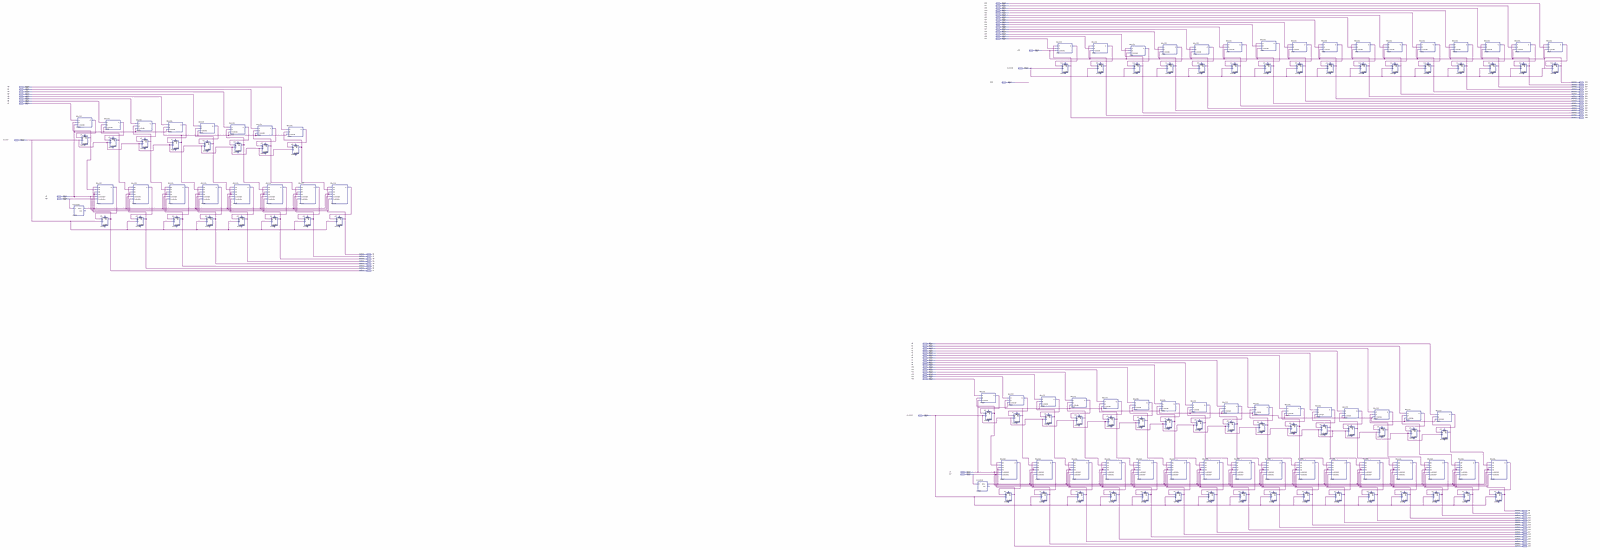
[diagram p0: schematic sheet, whole]
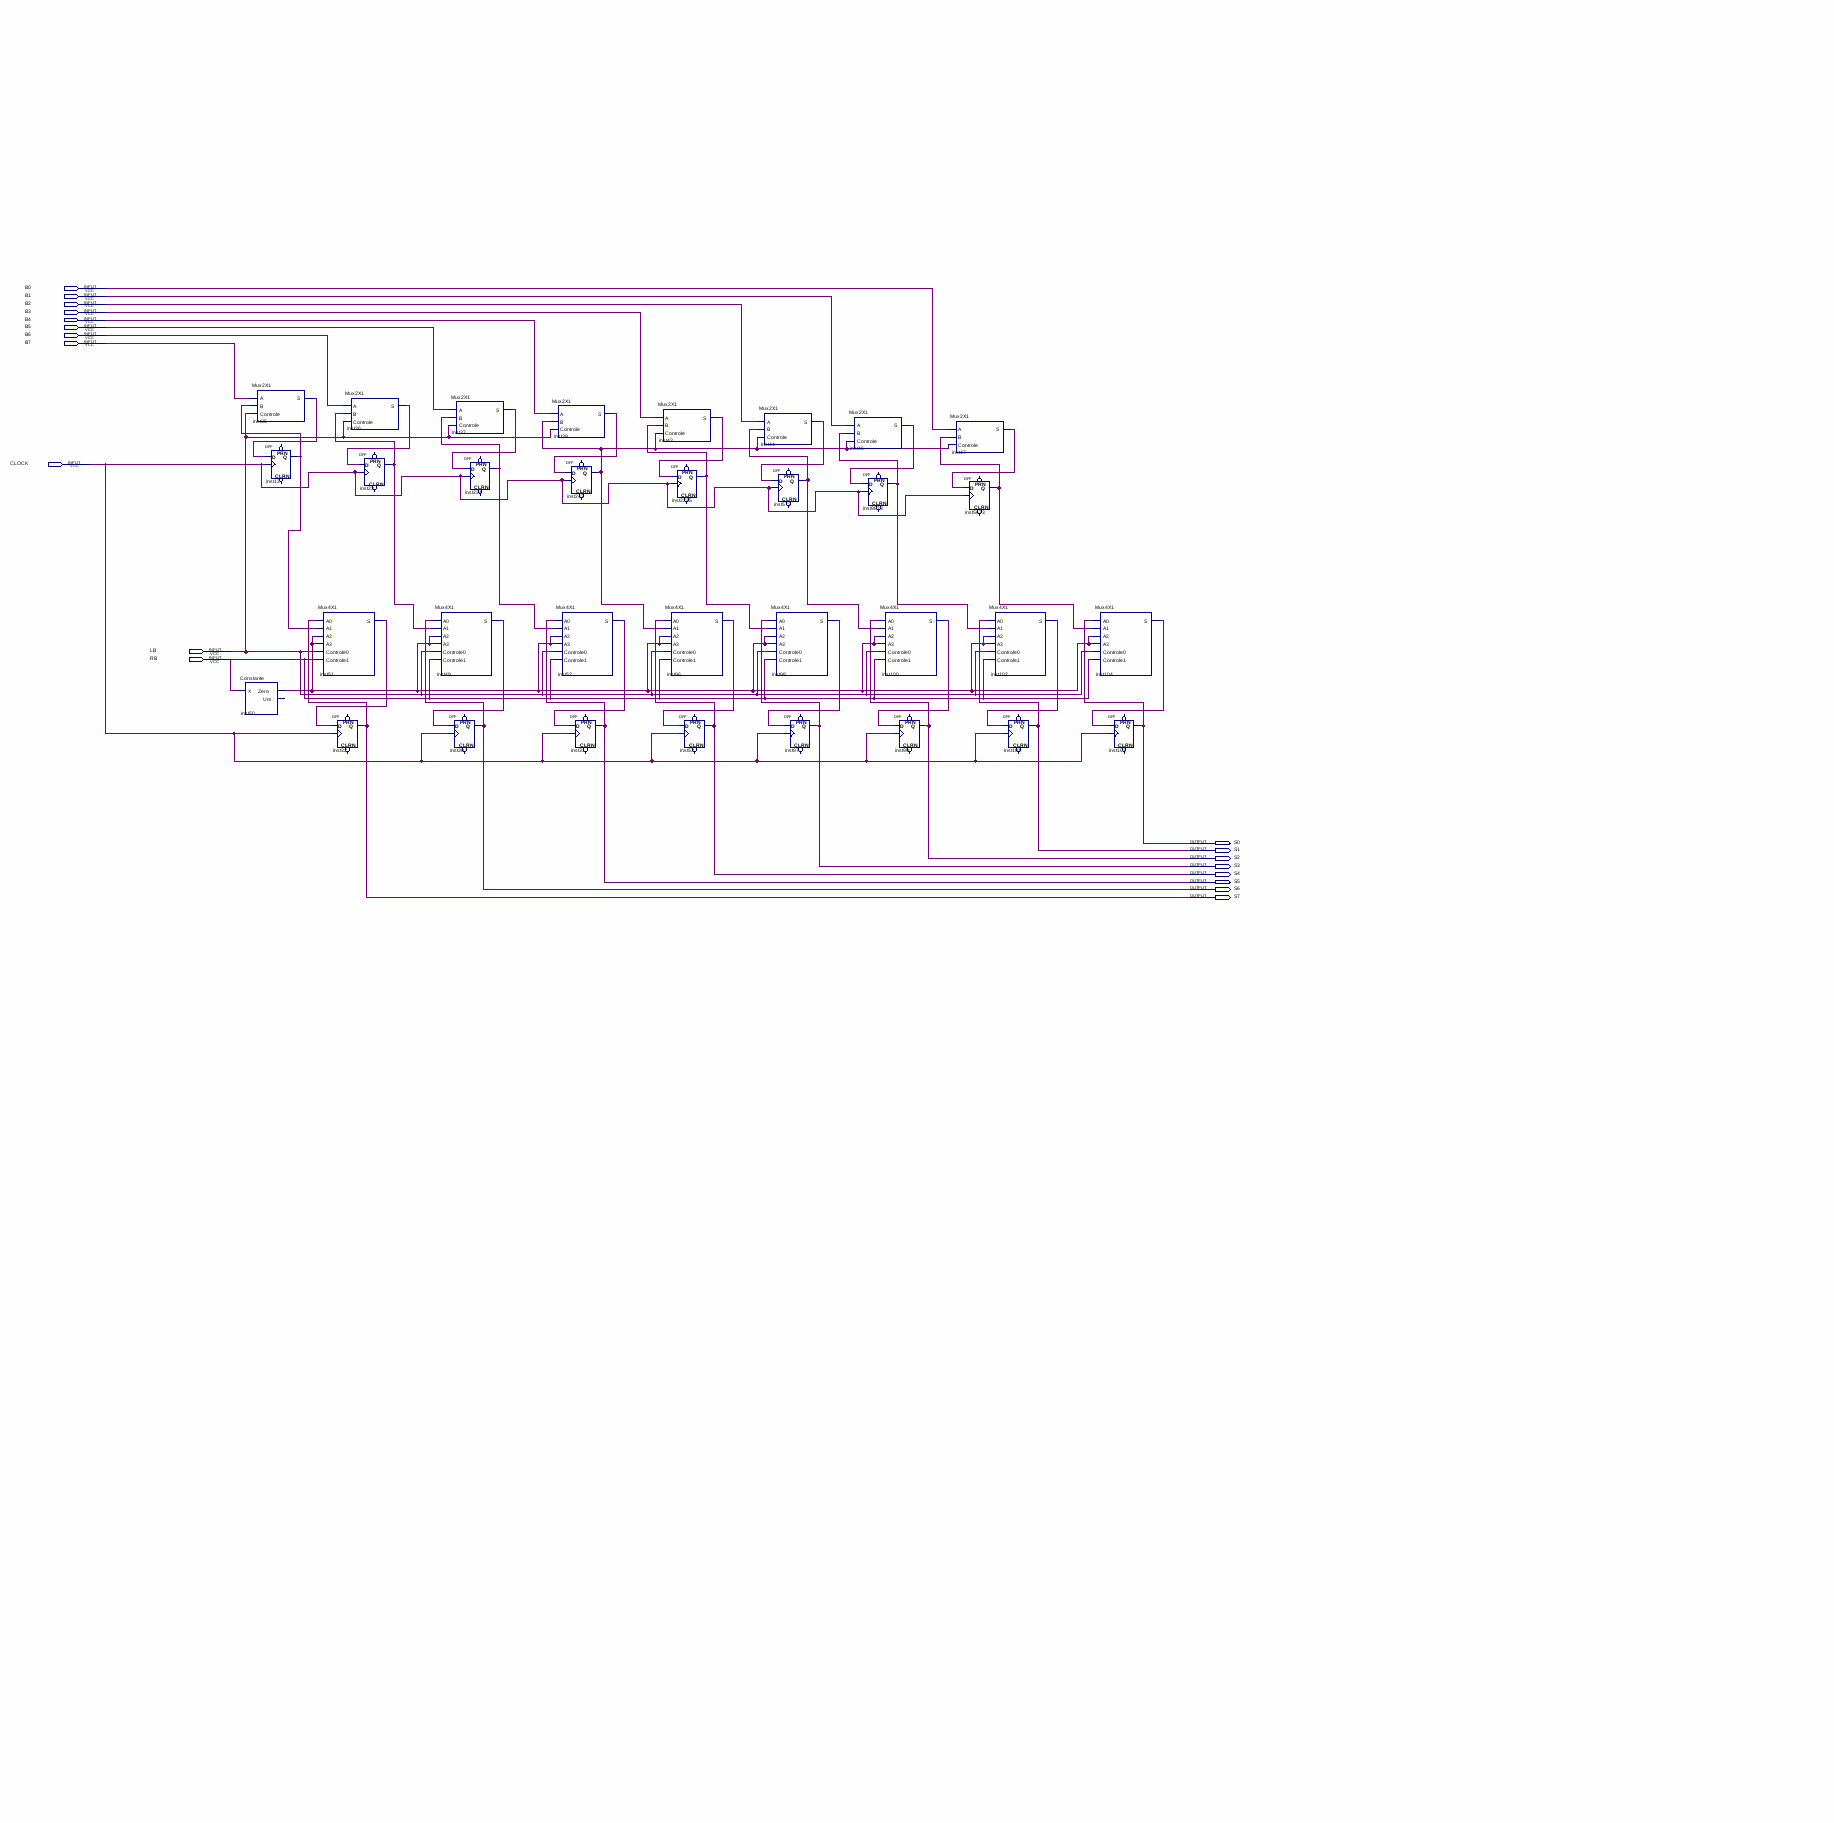
[diagram p1: schematic sheet, left part]
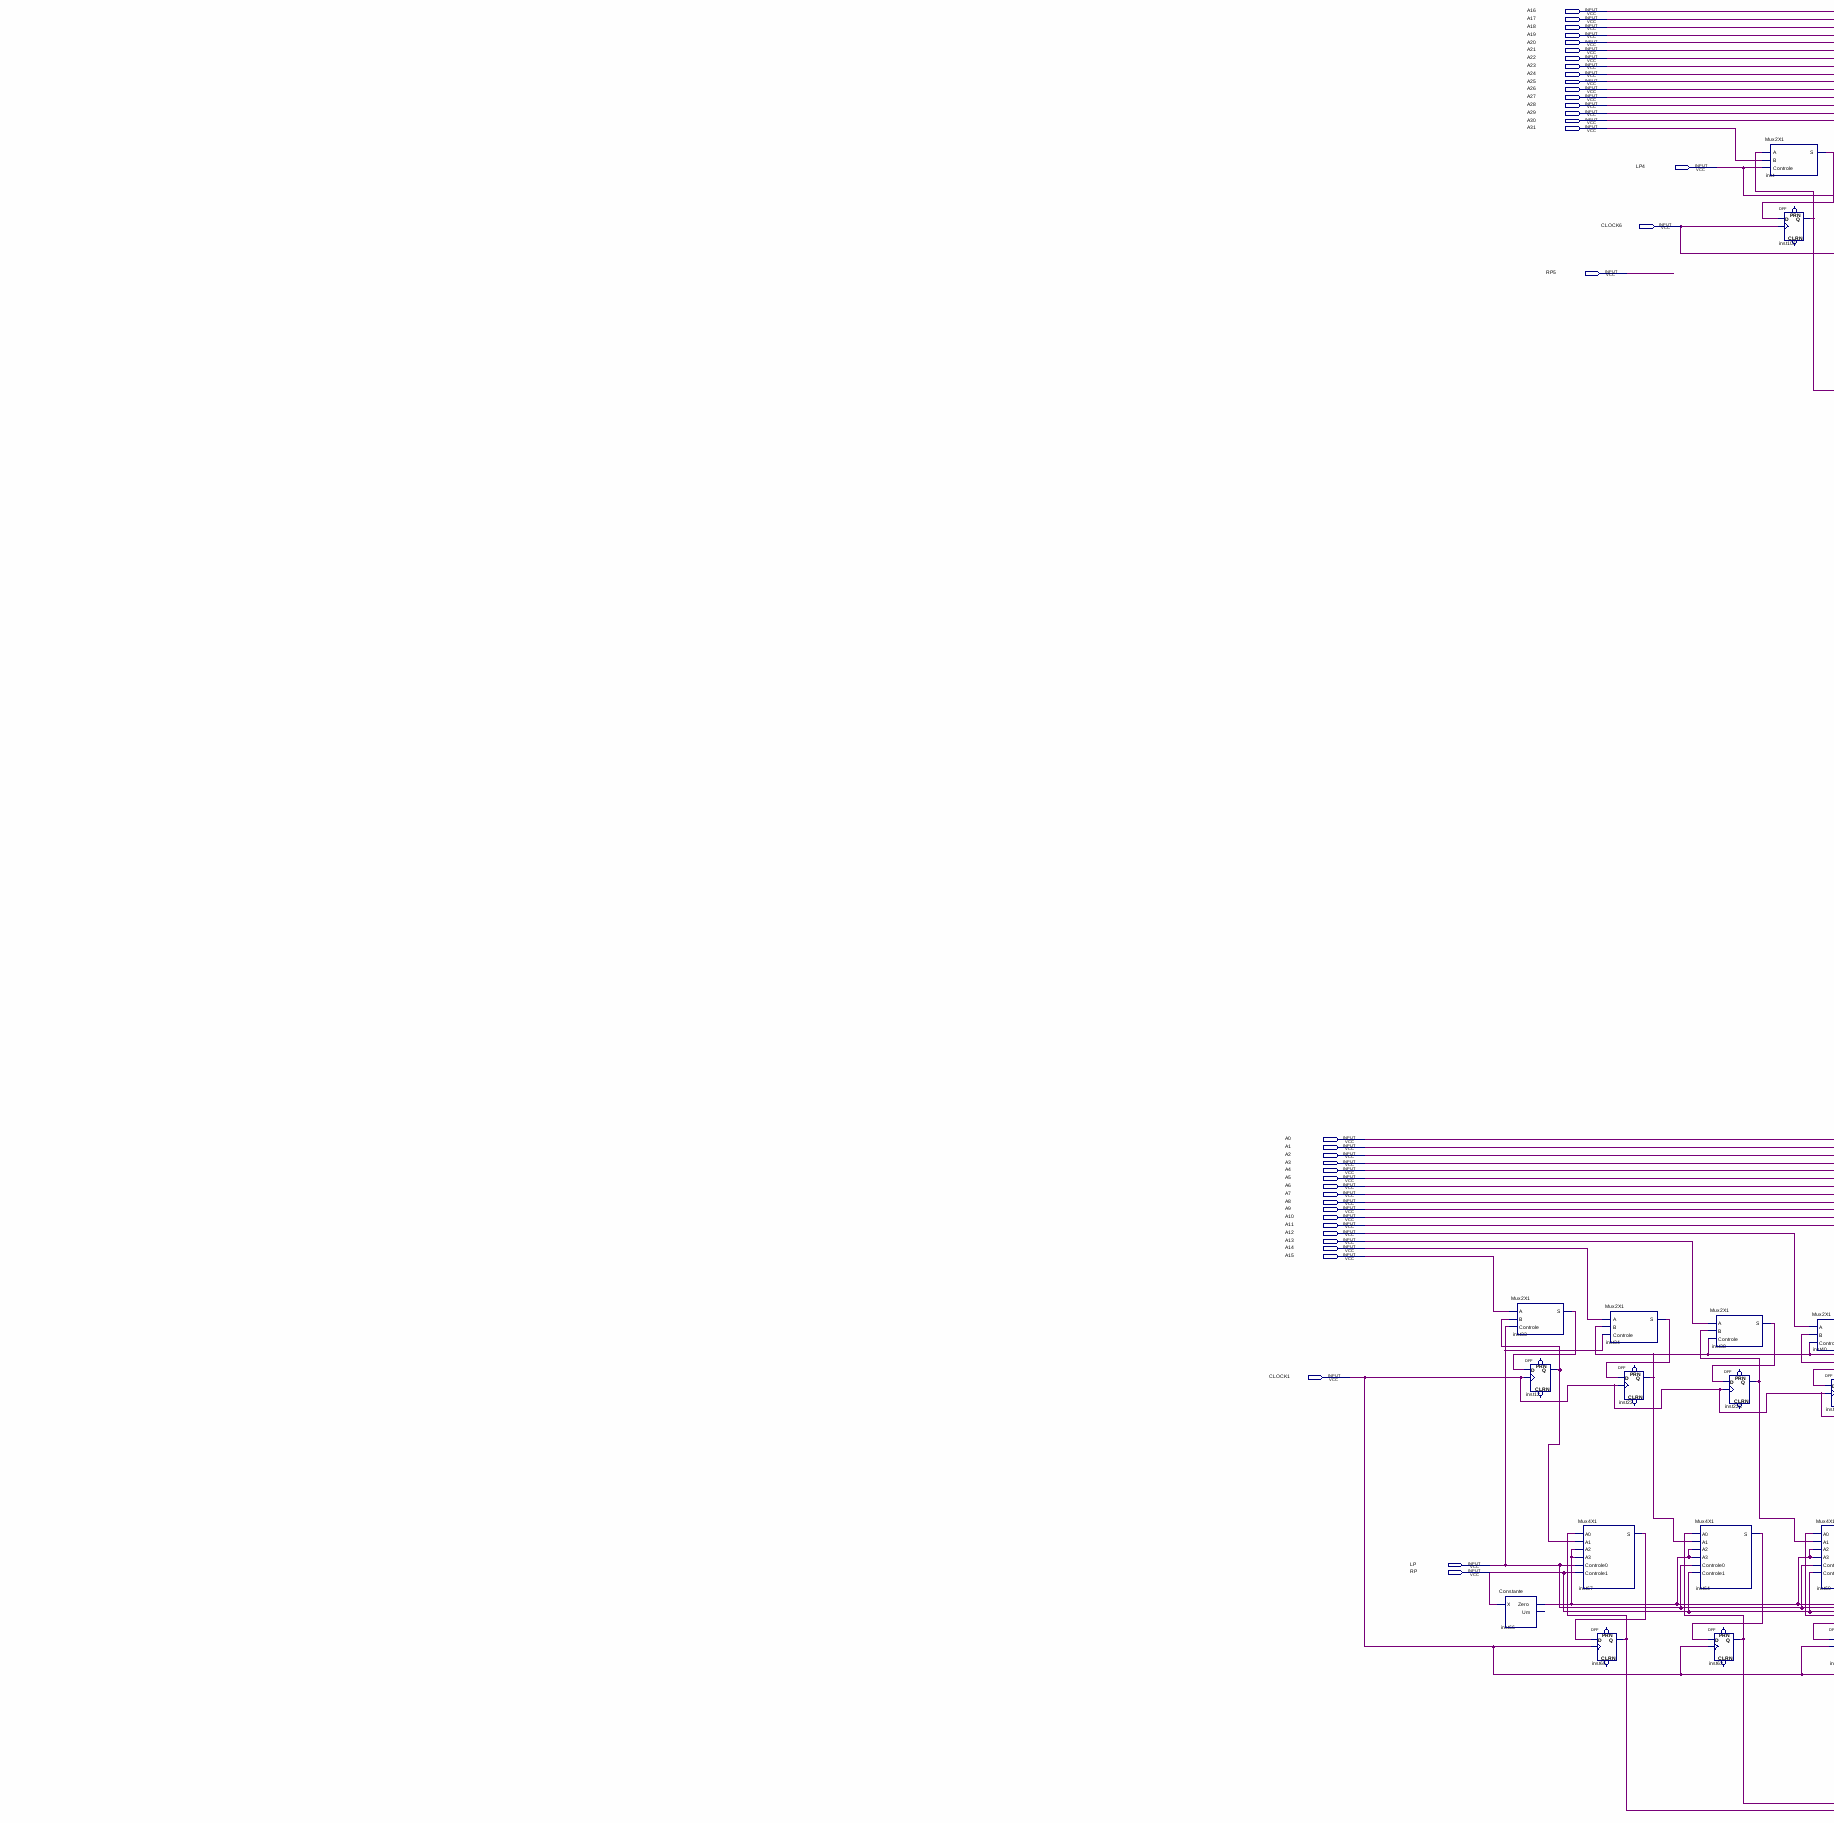
[diagram p2: schematic sheet, centre part]
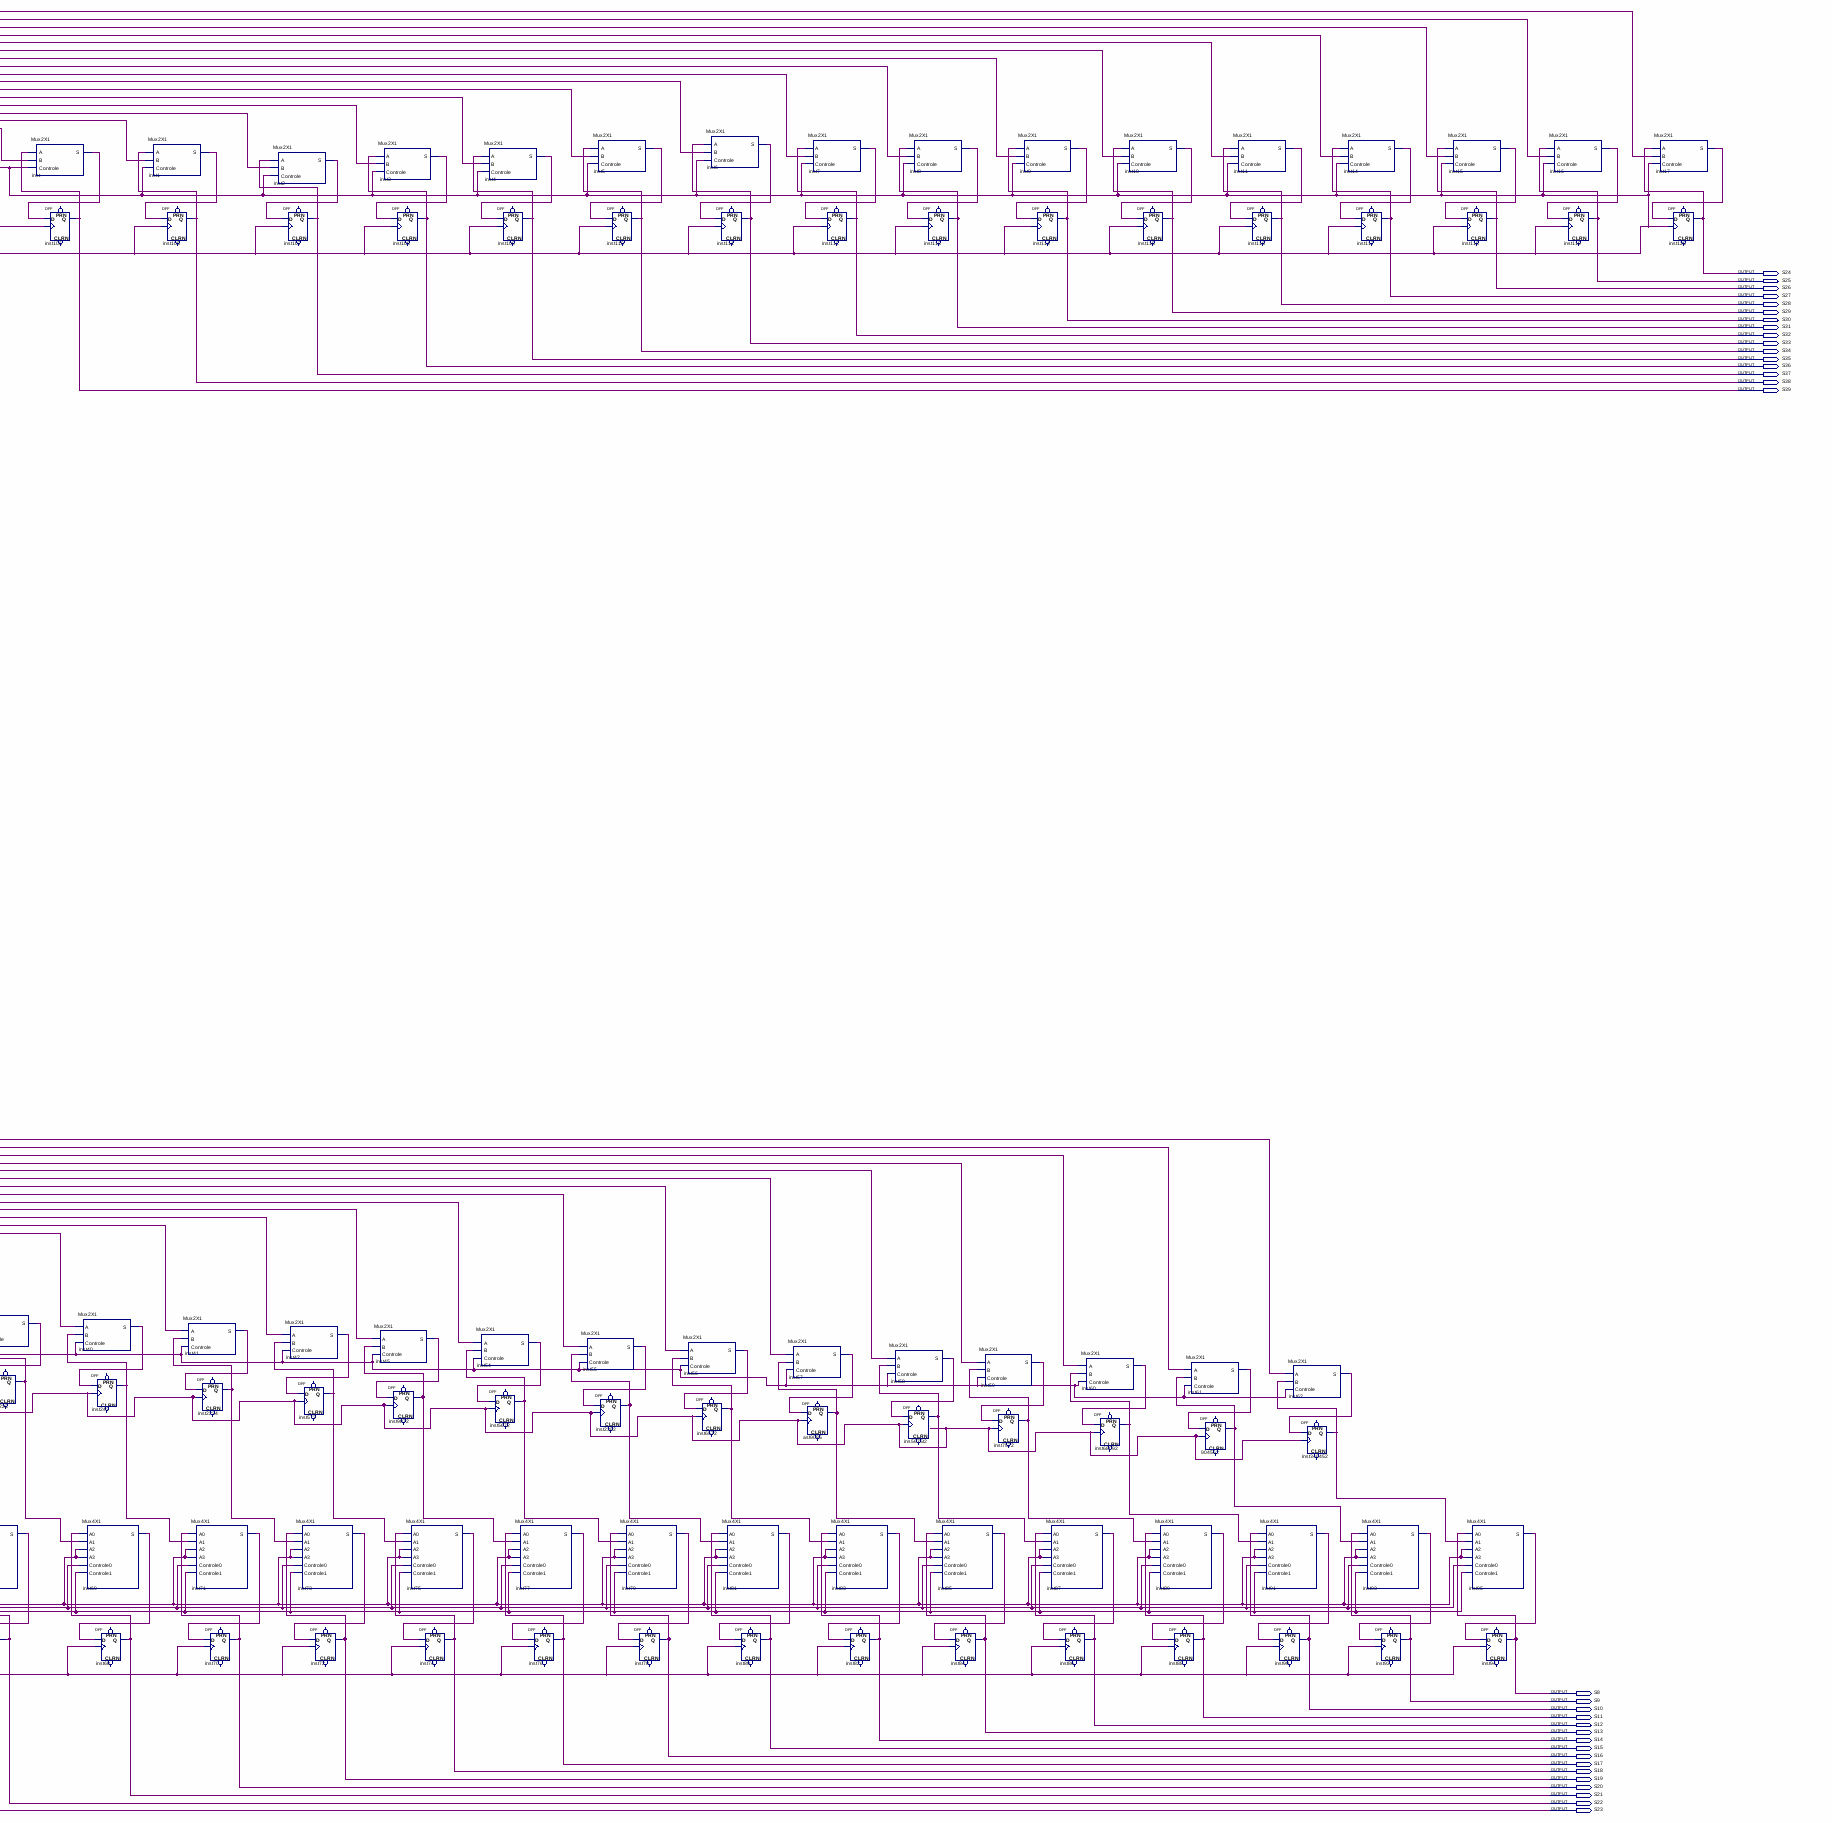
[diagram p3: schematic sheet, right part]
// Quartus schematic Rascunho.bdf as structural Verilog: 130 symbols, 89 pins
module Rascunho (
  input  A16,
  input  A17,
  input  A18,
  input  A19,
  input  A20,
  input  A21,
  input  A22,
  input  A23,
  input  A24,
  input  A25,
  input  A26,
  input  A27,
  input  A28,
  input  A29,
  input  A30,
  input  A31,
  input  LP4,
  input  CLOCK6,
  input  RP5,
  input  B0,
  input  B1,
  input  B2,
  input  B3,
  input  B4,
  input  B5,
  input  B6,
  input  B7,
  input  CLOCK,
  input  LB,
  input  RB,
  input  A0,
  input  A1,
  input  A2,
  input  A3,
  input  A4,
  input  A5,
  input  A6,
  input  A7,
  input  A8,
  input  A9,
  input  A10,
  input  A11,
  input  A12,
  input  A13,
  input  A14,
  input  A15,
  input  CLOCK1,
  input  LP,
  input  RP,
  output S24,
  output S25,
  output S26,
  output S27,
  output S28,
  output S29,
  output S30,
  output S31,
  output S32,
  output S33,
  output S34,
  output S35,
  output S36,
  output S37,
  output S38,
  output S39,
  output S0,
  output S1,
  output S2,
  output S3,
  output S4,
  output S5,
  output S6,
  output S7,
  output S8,
  output S9,
  output S10,
  output S11,
  output S12,
  output S13,
  output S14,
  output S15,
  output S16,
  output S17,
  output S18,
  output S19,
  output S20,
  output S21,
  output S22,
  output S23
);

  wire asf9085_q, ins5675t2_q, inst1_s, inst2_s, inst3_s, inst4_s, inst5_s, inst6_s, inst7_s, inst8_s,
       inst9_s, inst10_s, inst11_s, inst12_q, inst13_q, inst14_s, inst15_s, inst16_s, inst17_s, inst22_q,
       inst23_q, inst33_s, inst34_s, inst35_s, inst36_s, inst37_s, inst38_s, inst39_s, inst40_s, inst41_s,
       inst42_s, inst43_s, inst44_s, inst45_s, inst46_s, inst47_s, inst49_s, inst50_zero, inst51_s, inst52_s,
       inst54_s, inst55_s, inst56_s, inst57_s, inst58_s, inst59_s, inst60_s, inst61_s, inst62_s, inst64_s,
       inst66_zero, inst67_s, inst69_s, inst71_s, inst73_s, inst75_s, inst77_s, inst79_s, inst81_s, inst83_s,
       inst85_s, inst87_s, inst89_s, inst91_s, inst93_s, inst95_s, inst96_s, inst98_s, inst100_s, inst102_s,
       inst104_s, inst223_q, inst224_q, inst242_q, inst243_q, inst572_q, inst573_q, inst2234_q, inst2235_q,
       inst2352_q, inst5672_q, inst5673_q, inst6572_q, inst7572_q, inst9872_q, inst9873_q, inst68092_q,
       inst346452_q, inst_s, n904562_q;

  Constante inst50 (.X(RB), .Zero(inst50_zero));  // open: Um
  Mux2X1 inst35 (.A(B7), .B(inst13_q), .Controle(LB), .S(inst35_s));
  DFF inst13 (.CLK(CLOCK), .D(inst35_s), .Q(inst13_q));  // open: CLRN, PRN
  Mux4X1 inst51 (
    .A0(S7), .A1(inst13_q), .A2(inst50_zero), .A3(inst50_zero), .Controle0(LB), .Controle1(RB), .S(inst51_s));
  DFF inst32 (.CLK(CLOCK), .D(inst51_s), .Q(S7));  // open: CLRN, PRN
  Mux2X1 inst36 (.A(B6), .B(inst23_q), .Controle(LB), .S(inst36_s));
  DFF inst23 (.CLK(CLOCK), .D(inst36_s), .Q(inst23_q));  // open: CLRN, PRN
  Mux4X1 inst49 (
    .A0(S6), .A1(inst23_q), .A2(inst50_zero), .A3(inst50_zero), .Controle0(LB), .Controle1(RB), .S(inst49_s));
  Mux2X1 inst37 (.A(B5), .B(inst224_q), .Controle(LB), .S(inst37_s));
  DFF inst224 (.CLK(CLOCK), .D(inst37_s), .Q(inst224_q));  // open: CLRN, PRN
  DFF inst30 (.CLK(CLOCK), .D(inst49_s), .Q(S6));  // open: CLRN, PRN
  Mux2X1 inst39 (.A(B4), .B(inst243_q), .Controle(LB), .S(inst39_s));
  Mux4X1 inst52 (
    .A0(S5), .A1(inst224_q), .A2(inst50_zero), .A3(inst50_zero), .Controle0(LB), .Controle1(RB), .S(inst52_s));
  DFF inst243 (.CLK(CLOCK), .D(inst39_s), .Q(inst243_q));  // open: CLRN, PRN
  DFF inst31 (.CLK(CLOCK), .D(inst52_s), .Q(S5));  // open: CLRN, PRN
  Mux2X1 inst43 (.A(B3), .B(inst2235_q), .Controle(inst243_q), .S(inst43_s));
  DFF inst2235 (.CLK(CLOCK), .D(inst43_s), .Q(inst2235_q));  // open: CLRN, PRN
  Mux4X1 inst96 (
    .A0(S4), .A1(inst243_q), .A2(inst50_zero), .A3(inst50_zero), .Controle0(LB), .Controle1(RB), .S(inst96_s));
  DFF inst53 (.CLK(CLOCK), .D(inst96_s), .Q(S4));  // open: CLRN, PRN
  Mux2X1 inst44 (.A(B2), .B(inst573_q), .Controle(inst243_q), .S(inst44_s));
  DFF inst573 (.CLK(CLOCK), .D(inst44_s), .Q(inst573_q));  // open: CLRN, PRN
  Mux4X1 inst98 (
    .A0(S3), .A1(inst2235_q), .A2(inst50_zero), .A3(inst50_zero), .Controle0(LB), .Controle1(RB), .S(inst98_s));
  DFF inst97 (.CLK(CLOCK), .D(inst98_s), .Q(S3));  // open: CLRN, PRN
  Mux2X1 inst46 (.A(B1), .B(inst9873_q), .Controle(inst243_q), .S(inst46_s));
  DFF inst9873 (.CLK(CLOCK), .D(inst46_s), .Q(inst9873_q));  // open: CLRN, PRN
  Mux4X1 inst100 (
    .A0(S2), .A1(inst573_q), .A2(inst50_zero), .A3(inst50_zero), .Controle0(LB), .Controle1(RB), .S(inst100_s));
  DFF inst99 (.CLK(CLOCK), .D(inst100_s), .Q(S2));  // open: CLRN, PRN
  Mux2X1 inst47 (.A(B0), .B(inst5673_q), .Controle(inst243_q), .S(inst47_s));
  DFF inst5673 (.CLK(CLOCK), .D(inst47_s), .Q(inst5673_q));  // open: CLRN, PRN
  Mux4X1 inst102 (
    .A0(S1), .A1(inst9873_q), .A2(inst50_zero), .A3(inst50_zero), .Controle0(LB), .Controle1(RB),
    .S(inst102_s));
  DFF inst101 (.CLK(CLOCK), .D(inst102_s), .Q(S1));  // open: CLRN, PRN
  Mux4X1 inst104 (
    .A0(S0), .A1(inst5673_q), .A2(inst50_zero), .A3(inst50_zero), .Controle0(LB), .Controle1(RB),
    .S(inst104_s));
  DFF inst103 (.CLK(CLOCK), .D(inst104_s), .Q(S0));  // open: CLRN, PRN
  Mux2X1 inst33 (.A(A15), .B(inst12_q), .Controle(LP), .S(inst33_s));
  Constante inst66 (.X(RP), .Zero(inst66_zero));  // open: Um
  DFF inst12 (.CLK(CLOCK1), .D(inst33_s), .Q(inst12_q));  // open: CLRN, PRN
  Mux2X1 inst34 (.A(A14), .B(inst22_q), .Controle(LP), .S(inst34_s));
  Mux4X1 inst67 (
    .A0(S23), .A1(inst12_q), .A2(inst66_zero), .A3(inst66_zero), .Controle0(LP), .Controle1(RP), .S(inst67_s));
  DFF inst65 (.CLK(CLOCK1), .D(inst67_s), .Q(S23));  // open: CLRN, PRN
  DFF inst22 (.CLK(CLOCK1), .D(inst34_s), .Q(inst22_q));  // open: CLRN, PRN
  Mux4X1 inst64 (
    .A0(S22), .A1(inst22_q), .A2(inst66_zero), .A3(inst66_zero), .Controle0(LP), .Controle1(RP), .S(inst64_s));
  Mux2X1 inst38 (.A(A13), .B(inst223_q), .Controle(inst22_q), .S(inst38_s));
  DFF inst223 (.CLK(CLOCK1), .D(inst38_s), .Q(inst223_q));  // open: CLRN, PRN
  DFF inst63 (.CLK(CLOCK1), .D(inst64_s), .Q(S22));  // open: CLRN, PRN
  Mux2X1 inst (.A(S39), .B(A31), .Controle(CLOCK6), .S(inst_s));
  DFF inst106 (.CLK(CLOCK6), .D(inst_s), .Q(S39));  // open: CLRN, PRN
  Mux2X1 inst40 (.A(A12), .B(inst242_q), .Controle(inst22_q), .S(inst40_s));
  Mux4X1 inst69 (
    .A0(S21), .A1(inst223_q), .A2(inst66_zero), .A3(inst66_zero), .Controle0(LP), .Controle1(RP), .S(inst69_s));
  DFF inst242 (.CLK(CLOCK1), .D(inst40_s), .Q(inst242_q));  // open: CLRN, PRN
  DFF inst68 (.CLK(CLOCK1), .D(inst69_s), .Q(S21));  // open: CLRN, PRN
  Mux2X1 inst1 (.A(S38), .B(A30), .Controle(CLOCK6), .S(inst1_s));
  DFF inst105 (.CLK(CLOCK6), .D(inst1_s), .Q(S38));  // open: CLRN, PRN
  Mux2X1 inst41 (.A(A11), .B(inst2234_q), .Controle(inst22_q), .S(inst41_s));
  DFF inst2234 (.CLK(CLOCK1), .D(inst41_s), .Q(inst2234_q));  // open: CLRN, PRN
  Mux4X1 inst71 (
    .A0(S20), .A1(inst242_q), .A2(inst66_zero), .A3(inst66_zero), .Controle0(LP), .Controle1(RP), .S(inst71_s));
  DFF inst70 (.CLK(CLOCK1), .D(inst71_s), .Q(S20));  // open: CLRN, PRN
  Mux2X1 inst2 (.A(S37), .B(A29), .Controle(CLOCK6), .S(inst2_s));
  DFF inst107 (.CLK(CLOCK6), .D(inst2_s), .Q(S37));  // open: CLRN, PRN
  Mux2X1 inst42 (.A(A10), .B(inst572_q), .Controle(inst22_q), .S(inst42_s));
  DFF inst572 (.CLK(CLOCK1), .D(inst42_s), .Q(inst572_q));  // open: CLRN, PRN
  Mux4X1 inst73 (
    .A0(S19), .A1(inst2234_q), .A2(inst66_zero), .A3(inst66_zero), .Controle0(LP), .Controle1(RP),
    .S(inst73_s));
  DFF inst72 (.CLK(CLOCK1), .D(inst73_s), .Q(S19));  // open: CLRN, PRN
  Mux2X1 inst3 (.A(S36), .B(A28), .Controle(CLOCK6), .S(inst3_s));
  DFF inst108 (.CLK(CLOCK6), .D(inst3_s), .Q(S36));  // open: CLRN, PRN
  Mux2X1 inst45 (.A(A9), .B(inst9872_q), .Controle(inst22_q), .S(inst45_s));
  DFF inst9872 (.CLK(CLOCK1), .D(inst45_s), .Q(inst9872_q));  // open: CLRN, PRN
  Mux4X1 inst75 (
    .A0(S18), .A1(inst572_q), .A2(inst66_zero), .A3(inst66_zero), .Controle0(LP), .Controle1(RP), .S(inst75_s));
  DFF inst74 (.CLK(CLOCK1), .D(inst75_s), .Q(S18));  // open: CLRN, PRN
  Mux2X1 inst4 (.A(S35), .B(A27), .Controle(CLOCK6), .S(inst4_s));
  Mux2X1 inst54 (.A(A8), .B(inst5672_q), .Controle(inst22_q), .S(inst54_s));
  DFF inst5672 (.CLK(CLOCK1), .D(inst54_s), .Q(inst5672_q));  // open: CLRN, PRN
  DFF inst109 (.CLK(CLOCK6), .D(inst4_s), .Q(S35));  // open: CLRN, PRN
  Mux4X1 inst77 (
    .A0(S17), .A1(inst9872_q), .A2(inst66_zero), .A3(inst66_zero), .Controle0(LP), .Controle1(RP),
    .S(inst77_s));
  DFF inst76 (.CLK(CLOCK1), .D(inst77_s), .Q(S17));  // open: CLRN, PRN
  Mux2X1 inst55 (.A(A7), .B(inst2352_q), .Controle(inst22_q), .S(inst55_s));
  Mux2X1 inst5 (.A(S34), .B(A26), .Controle(CLOCK6), .S(inst5_s));
  DFF inst110 (.CLK(CLOCK6), .D(inst5_s), .Q(S34));  // open: CLRN, PRN
  DFF inst2352 (.CLK(CLOCK1), .D(inst55_s), .Q(inst2352_q));  // open: CLRN, PRN
  Mux4X1 inst79 (
    .A0(S16), .A1(inst5672_q), .A2(inst66_zero), .A3(inst66_zero), .Controle0(LP), .Controle1(RP),
    .S(inst79_s));
  DFF inst78 (.CLK(CLOCK1), .D(inst79_s), .Q(S16));  // open: CLRN, PRN
  Mux2X1 inst56 (.A(A6), .B(inst6572_q), .Controle(inst22_q), .S(inst56_s));
  Mux2X1 inst6 (.A(S33), .B(A25), .Controle(CLOCK6), .S(inst6_s));
  DFF inst6572 (.CLK(CLOCK1), .D(inst56_s), .Q(inst6572_q));  // open: CLRN, PRN
  DFF inst111 (.CLK(CLOCK6), .D(inst6_s), .Q(S33));  // open: CLRN, PRN
  Mux4X1 inst81 (
    .A0(S15), .A1(inst2352_q), .A2(inst66_zero), .A3(inst66_zero), .Controle0(LP), .Controle1(RP),
    .S(inst81_s));
  DFF inst80 (.CLK(CLOCK1), .D(inst81_s), .Q(S15));  // open: CLRN, PRN
  Mux2X1 inst7 (.A(S32), .B(A24), .Controle(CLOCK6), .S(inst7_s));
  Mux2X1 inst57 (.A(A5), .B(asf9085_q), .Controle(inst22_q), .S(inst57_s));
  DFF asf9085 (.CLK(CLOCK1), .D(inst57_s), .Q(asf9085_q));  // open: CLRN, PRN
  DFF inst112 (.CLK(CLOCK6), .D(inst7_s), .Q(S32));  // open: CLRN, PRN
  Mux4X1 inst83 (
    .A0(S14), .A1(inst6572_q), .A2(inst66_zero), .A3(inst66_zero), .Controle0(LP), .Controle1(RP),
    .S(inst83_s));
  DFF inst82 (.CLK(CLOCK1), .D(inst83_s), .Q(S14));  // open: CLRN, PRN
  Mux2X1 inst58 (.A(A4), .B(ins5675t2_q), .Controle(inst22_q), .S(inst58_s));
  Mux2X1 inst8 (.A(S31), .B(A23), .Controle(CLOCK6), .S(inst8_s));
  DFF inst113 (.CLK(CLOCK6), .D(inst8_s), .Q(S31));  // open: CLRN, PRN
  DFF ins5675t2 (.CLK(CLOCK1), .D(inst58_s), .Q(ins5675t2_q));  // open: CLRN, PRN
  Mux4X1 inst85 (
    .A0(S13), .A1(asf9085_q), .A2(inst66_zero), .A3(inst66_zero), .Controle0(LP), .Controle1(RP), .S(inst85_s));
  DFF inst84 (.CLK(CLOCK1), .D(inst85_s), .Q(S13));  // open: CLRN, PRN
  Mux2X1 inst59 (.A(A3), .B(inst7572_q), .Controle(inst22_q), .S(inst59_s));
  DFF inst7572 (.CLK(CLOCK1), .D(inst59_s), .Q(inst7572_q));  // open: CLRN, PRN
  Mux2X1 inst9 (.A(S30), .B(A22), .Controle(CLOCK6), .S(inst9_s));
  DFF inst114 (.CLK(CLOCK6), .D(inst9_s), .Q(S30));  // open: CLRN, PRN
  Mux4X1 inst87 (
    .A0(S12), .A1(ins5675t2_q), .A2(inst66_zero), .A3(inst66_zero), .Controle0(LP), .Controle1(RP),
    .S(inst87_s));
  Mux2X1 inst60 (.A(A2), .B(inst68092_q), .Controle(inst22_q), .S(inst60_s));
  DFF inst86 (.CLK(CLOCK1), .D(inst87_s), .Q(S12));  // open: CLRN, PRN
  DFF inst68092 (.CLK(CLOCK1), .D(inst60_s), .Q(inst68092_q));  // open: CLRN, PRN
  Mux2X1 inst10 (.A(S29), .B(A21), .Controle(CLOCK6), .S(inst10_s));
  DFF inst115 (.CLK(CLOCK6), .D(inst10_s), .Q(S29));  // open: CLRN, PRN
  Mux4X1 inst89 (
    .A0(S11), .A1(inst7572_q), .A2(inst66_zero), .A3(inst66_zero), .Controle0(LP), .Controle1(RP),
    .S(inst89_s));
  DFF inst88 (.CLK(CLOCK1), .D(inst89_s), .Q(S11));  // open: CLRN, PRN
  Mux2X1 inst61 (.A(A1), .B(n904562_q), .Controle(inst22_q), .S(inst61_s));
  DFF u_904562 (.CLK(CLOCK1), .D(inst61_s), .Q(n904562_q));  // open: CLRN, PRN
  Mux2X1 inst11 (.A(S28), .B(A20), .Controle(CLOCK6), .S(inst11_s));
  DFF inst116 (.CLK(CLOCK6), .D(inst11_s), .Q(S28));  // open: CLRN, PRN
  Mux4X1 inst91 (
    .A0(S10), .A1(inst68092_q), .A2(inst66_zero), .A3(inst66_zero), .Controle0(LP), .Controle1(RP),
    .S(inst91_s));
  DFF inst90 (.CLK(CLOCK1), .D(inst91_s), .Q(S10));  // open: CLRN, PRN
  Mux2X1 inst62 (.A(A0), .B(inst346452_q), .Controle(inst22_q), .S(inst62_s));
  DFF inst346452 (.CLK(CLOCK1), .D(inst62_s), .Q(inst346452_q));  // open: CLRN, PRN
  Mux2X1 inst14 (.A(S27), .B(A19), .Controle(CLOCK6), .S(inst14_s));
  DFF inst117 (.CLK(CLOCK6), .D(inst14_s), .Q(S27));  // open: CLRN, PRN
  Mux4X1 inst93 (
    .A0(S9), .A1(n904562_q), .A2(inst66_zero), .A3(inst66_zero), .Controle0(LP), .Controle1(RP), .S(inst93_s));
  DFF inst92 (.CLK(CLOCK1), .D(inst93_s), .Q(S9));  // open: CLRN, PRN
  Mux2X1 inst15 (.A(S26), .B(A18), .Controle(CLOCK6), .S(inst15_s));
  DFF inst118 (.CLK(CLOCK6), .D(inst15_s), .Q(S26));  // open: CLRN, PRN
  Mux4X1 inst95 (
    .A0(S8), .A1(inst346452_q), .A2(inst66_zero), .A3(inst66_zero), .Controle0(LP), .Controle1(RP),
    .S(inst95_s));
  DFF inst94 (.CLK(CLOCK1), .D(inst95_s), .Q(S8));  // open: CLRN, PRN
  Mux2X1 inst16 (.A(S25), .B(A17), .Controle(CLOCK6), .S(inst16_s));
  DFF inst119 (.CLK(CLOCK6), .D(inst16_s), .Q(S25));  // open: CLRN, PRN
  Mux2X1 inst17 (.A(S24), .B(A16), .Controle(CLOCK6), .S(inst17_s));
  DFF inst120 (.CLK(CLOCK6), .D(inst17_s), .Q(S24));  // open: CLRN, PRN

  assign LP4 = CLOCK6;
endmodule
